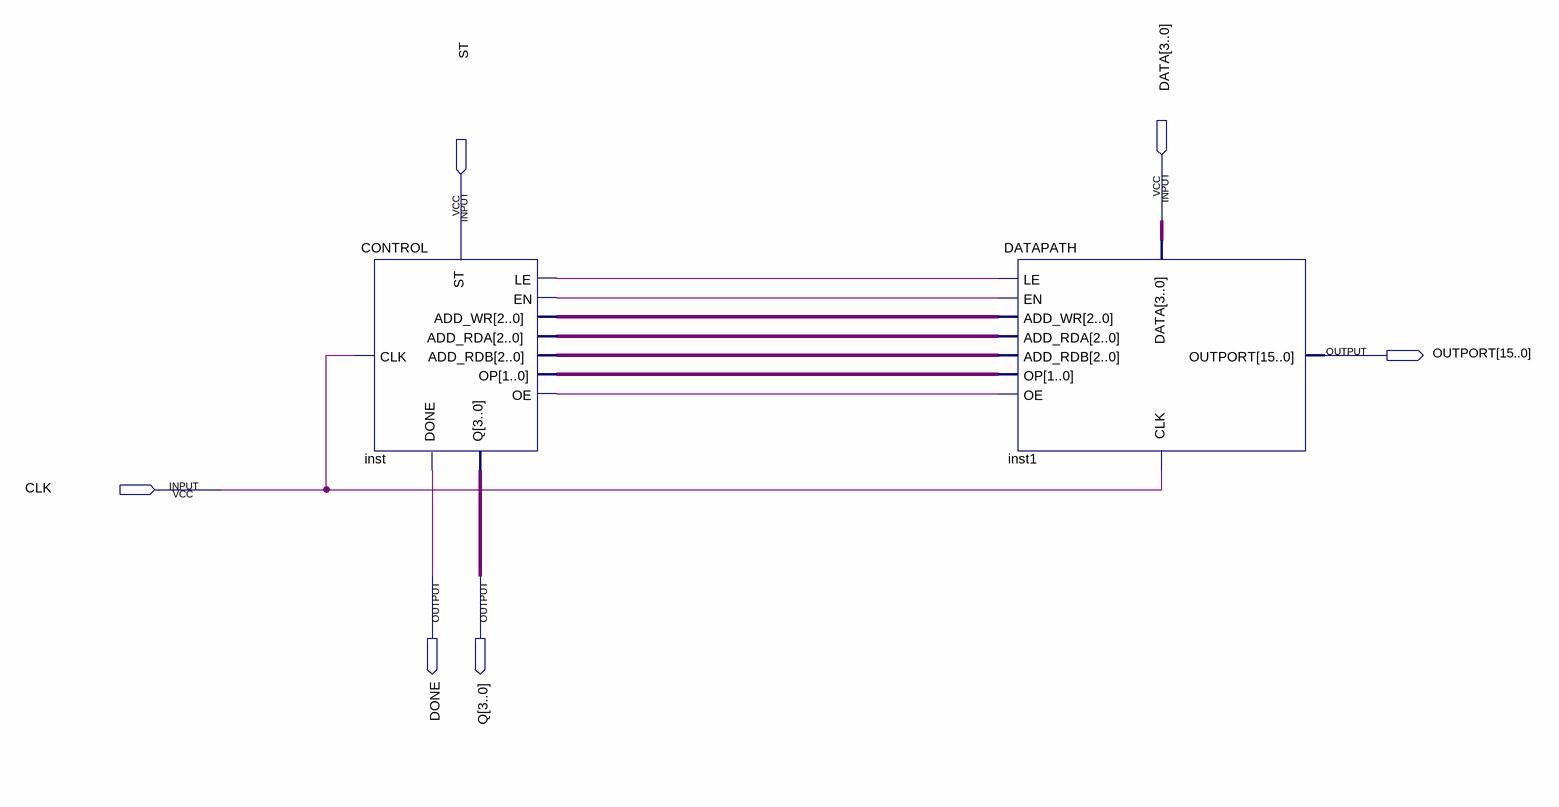
[diagram p0: schematic sheet]
// Quartus schematic LAB4.bdf as structural Verilog: 2 symbols, 6 pins
module LAB4 (
  input  [3:0] DATA,
  input  ST,
  input  CLK,
  output [15:0] OUTPORT,
  output DONE,
  output [3:0] Q
);

  wire inst_en, inst_le, inst_oe;
  wire [1:0] inst_op;
  wire [2:0] inst_add_rda, inst_add_rdb, inst_add_wr;

  CONTROL inst (
    .ST(ST), .CLK(CLK), .LE(inst_le), .EN(inst_en), .ADD_WR(inst_add_wr), .ADD_RDA(inst_add_rda),
    .ADD_RDB(inst_add_rdb), .OP(inst_op), .OE(inst_oe), .DONE(DONE), .Q(Q));
  DATAPATH inst1 (
    .LE(inst_le), .EN(inst_en), .ADD_WR(inst_add_wr), .ADD_RDA(inst_add_rda), .ADD_RDB(inst_add_rdb),
    .OP(inst_op), .OE(inst_oe), .DATA(DATA), .CLK(CLK), .OUTPORT(OUTPORT));
endmodule
